# Altium schematic sheet Stm32F103C8T6.SchDoc
size 420 x 297 mm; SheetNumber: 5; SheetTotal: 6
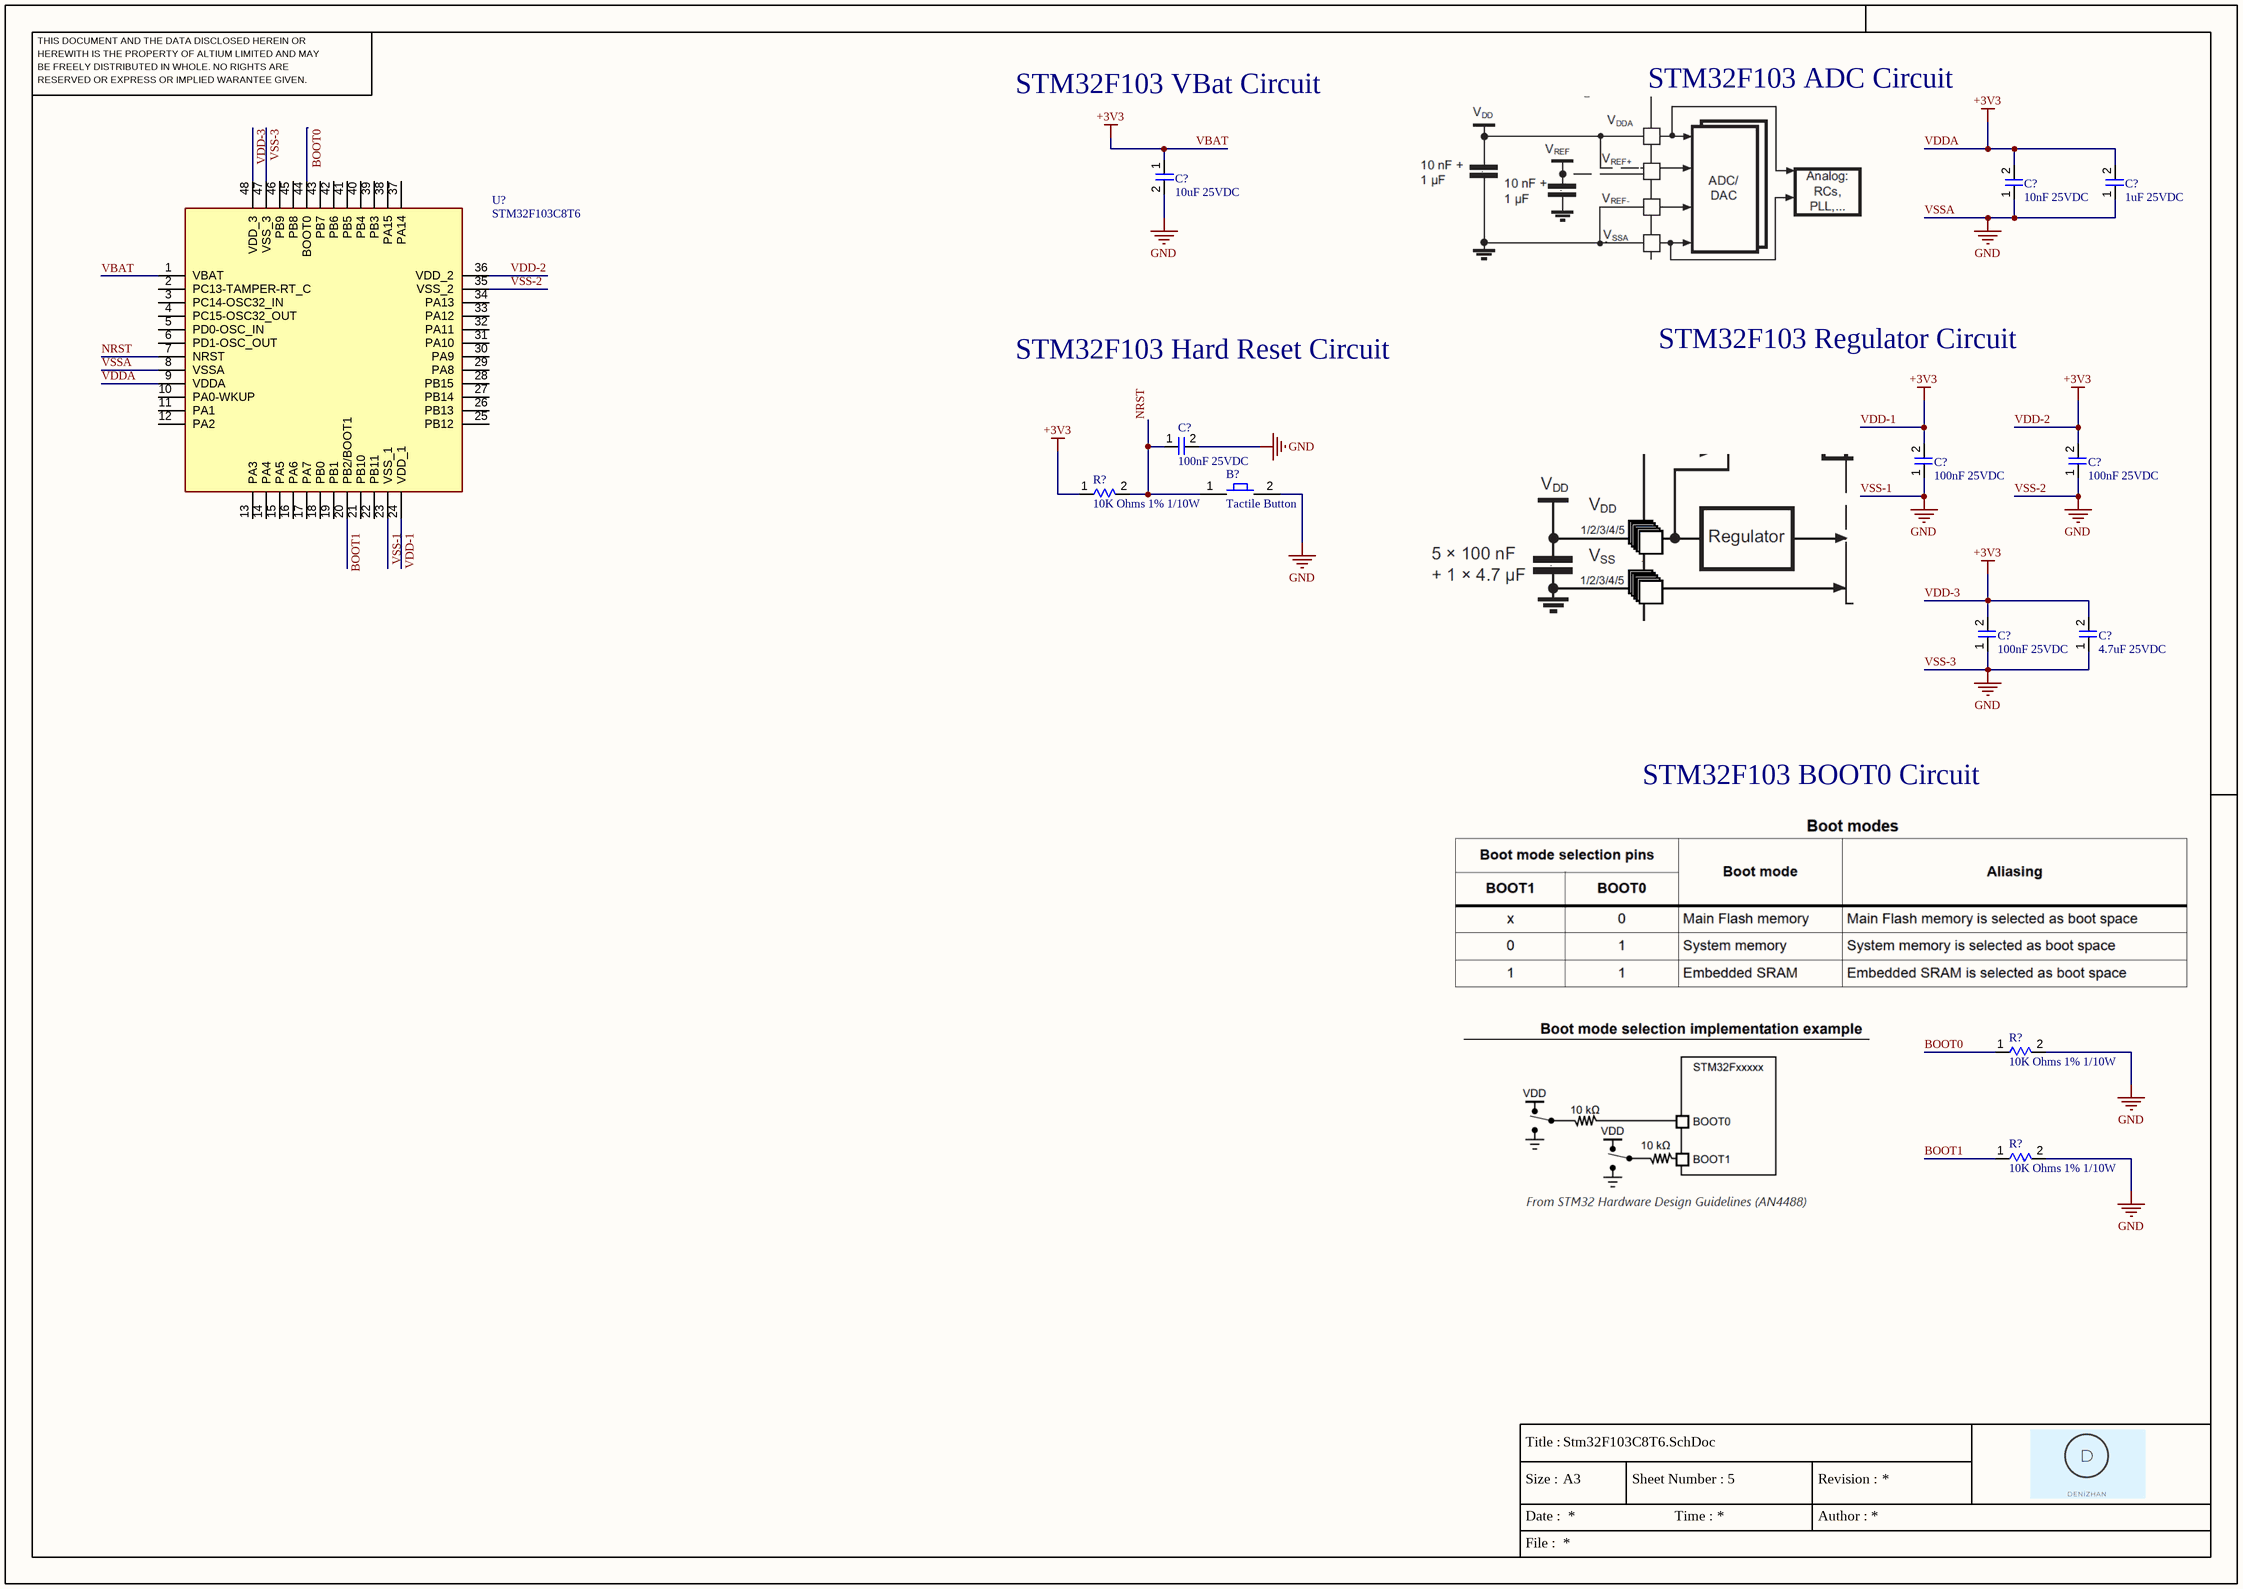
[diagram p0: Stm32F103C8T6.SchDoc]

## Parts
(Parts that share a designator on the sheet are numbered #1, #2 ... from top to bottom, then left to right.)
B?  Tactile Button  [Tactal Switch - SMD (6mm x 6mm x 12mm)]
C?#1  10uF 25VDC  [0603_UnP_Capacitor]
C?#2  10nF 25VDC  [0603_UnP_Capacitor]
C?#3  1uF 25VDC  [0603_UnP_Capacitor]
C?#4  100nF 25VDC  [0603_UnP_Capacitor]
C?#5  100nF 25VDC  [0603_UnP_Capacitor]
C?#6  100nF 25VDC  [0603_UnP_Capacitor]
C?#7  100nF 25VDC  [0603_UnP_Capacitor]
C?#8  4.7uF 25VDC  [0603_UnP_Capacitor]
R?#1  10K Ohms 1% 1/10W  [0603_Resistor_Case]
R?#2  10K Ohms 1% 1/10W  [0603_Resistor_Case]
R?#3  10K Ohms 1% 1/10W  [0603_Resistor_Case]
U?  STM32F103C8T6  [STM32F103-48N]

## Nets
VBAT: C?#1.1 C?#2.2 C?#3.2 C?#5.2 C?#6.2 C?#7.2 C?#8.2 R?#1.1 U?.1(VBAT) U?.9(VDDA) U?.24(VDD_1) U?.36(VDD_2) U?.48(VDD_3)  [also labelled +3V3, VDD-1, VDD-2, VDD-3, VDDA]
VSS-1: B?.2 C?#1.2 C?#2.1 C?#3.1 C?#4.2 C?#5.1 C?#6.1 C?#7.1 C?#8.1 R?#2.2 R?#3.2 U?.8(VSSA) U?.23(VSS_1) U?.35(VSS_2) U?.47(VSS_3)  [also labelled GND, VSS-2, VSS-3, VSSA]
BOOT0: R?#2.1 U?.44(BOOT0)
BOOT1: R?#3.1 U?.20(PB2/BOOT1)
NRST: B?.1 C?#4.1 R?#1.2 U?.7(NRST)

Not connected (* = marked no-connect by the designer): U? 2(PC13-TAMPER-RT_C) 3(PC14-OSC32_IN) 4(PC15-OSC32_OUT) 5(PD0-OSC_IN) 6(PD1-OSC_OUT) 10(PA0-WKUP) 11(PA1) 12(PA2) 13(PA3) 14(PA4) 15(PA5) 16(PA6) 17(PA7) 18(PB0) 19(PB1) 21(PB10) 22(PB11) 25(PB12) 26(PB13) 27(PB14) 28(PB15) 29(PA8) 30(PA9) 31(PA10) 32(PA11) 33(PA12) 34(PA13) 37(PA14) 38(PA15) 39(PB3) 40(PB4) 41(PB5) 42(PB6) 43(PB7) 45(PB8) 46(PB9)

## Notes on the sheet
- STM32F103 VBat Circuit
- STM32F103 ADC Circuit
- STM32F103 Hard Reset Circuit
- STM32F103 Regulator Circuit
- STM32F103 BOOT0 Circuit
- THIS DOCUMENT AND THE DATA DISCLOSED HEREIN OR
- HEREWITH IS THE PROPERTY OF ALTIUM LIMITED AND MAY
- BE FREELY DISTRIBUTED IN WHOLE. NO RIGHTS ARE
- RESERVED OR EXPRESS OR IMPLIED WARANTEE GIVEN.
- Title :
- Size :
- Date :
- A3
- Sheet Number :
- Time :
- Revision :
- Author :
- File :

## Library data of the parts
B? = Tactile Button: Basic Push Button SMD (6mm x 6mm x 12mm); Button Type: Tactal; Library Ref: Button; Button Size (From Bottom): 12mm; Availability: Available; Package: SMD
C?#1 = MCF03MTX250106 - MLCC 0603 10uF 25VDC ±20% X5R: MCF03MTX250106 - MLCC (1608) 0603 10uF 25VDC ±20% X5R; Manufacturer: VIKING; Capacitor Type: Ceramic; Capacitance: 10µF; Case/Size Code: 0603; Library Ref: Capacitors; Part Number: MCF03MTX250106; ComponentLink1Description: New link; ComponentLink1URL: https://www.ozdisan.com/passive-components/resistors/smt-smd-and-chip-resistors/PS03W4F1003T5E/592727; Max Working Voltage: 25VDC; Availability: Available; Package: SMD
C?#2 = CC0603KRX7R8BB103 - MLCC (1608) 0603 10nF 25VDC ±10% X7R: Manufacturer: YAGEO; Part Number: CL10B105KA8NNNC; Capacitor Type: Unpolarized; Max Working Voltage: 25V; Case/Size Code: 0603; Library Ref: Capacitors; ComponentLink1Description: New link; ComponentLink1URL: https://www.ozdisan.com/passive-components/resistors/smt-smd-and-chip-resistors/PS03W4F1003T5E/592727; Availability: Available; Package: SMD; Capacitance: 10nF
C?#3 = CL10B105KA8NNNC - MLCC (1608) 0603 1uF 25VDC ±10% X7R: Manufacturer: SAMSUNG; Capacitor Type: Unpolarized; Max Working Voltage: 25V; Case/Size Code: 0603; Library Ref: Capacitors; Part Number: CL10B105KA8NNNC; ComponentLink1Description: New link; ComponentLink1URL: https://www.ozdisan.com/passive-components/resistors/smt-smd-and-chip-resistors/PS03W4F1003T5E/592727; Availability: Available; Package: SMD; Capacitance: 1uF
C?#4-C?#7 = MCF03KTB250104 - MLCC (1608) 0603 100nF 25VDC ±10% X7R: Manufacturer: SAMSUNG; Capacitor Type: Ceramic; Max Working Voltage: 25V; Case/Size Code: 0603; Library Ref: Capacitors; Part Number: MCF03KTB250104; ComponentLink1Description: New link; ComponentLink1URL: https://www.ozdisan.com/passive-components/capacitors/smt-smd-and-mlcc-capacitors/CL10B392KB8NNNC/26336; Availability: Available; Package: SMD; Capacitance: 100nF
C?#8 = CL10A475KA8NQNC - MLCC (1608) 0603 4.7uF 25VDC ±10% X5R: Manufacturer: SAMSUNG; Capacitor Type: Unpolarized; Max Working Voltage: 25V; Capacitance: 4.7µF; Case/Size Code: 0603; Library Ref: Capacitors; Part Number: CL10A475KA8NQNC; ComponentLink1Description: New link; ComponentLink1URL: https://www.ozdisan.com/passive-components/capacitors/smt-smd-and-mlcc-capacitors/CL10B392KB8NNNC/26336; Availability: Available; Package: SMD
R?#1-R?#3 = RC0603FR-0710KL - 0603 10K Ohms 1% 1/10W 100PPM: Manufacturer: HOTTECH; Part Number: PS03W4F1003T5E; Max Working Voltage: 75V; Case/Size Code: 0603; Library Ref: Resistors; Power (Watts): 1/10W; Resistor Value: 10K Ohms; ComponentLink1Description: New link; ComponentLink1URL: https://www.ozdisan.com/passive-components/resistors/smt-smd-and-chip-resistors/PS03W4F1003T5E/592727; Availability: Available; Package: SMD
U? = STM32F103C8T6: ARM® Cortex®-M3 STM32F1 Microcontroller IC 32-Bit 72MHz 64KB (64K x 8) FLASH 48-LQFP (7x7); Manufacturer: STMicroelectronics; Library Ref: Microprocessors; Pin Count: 48; Availability: Available; Package: SMD